# Altium schematic sheet Power.SchDoc
size 292 x 193 mm; Author: Power Lin; SheetNumber: 1; SheetTotal: 1; Website: wiki-power.com
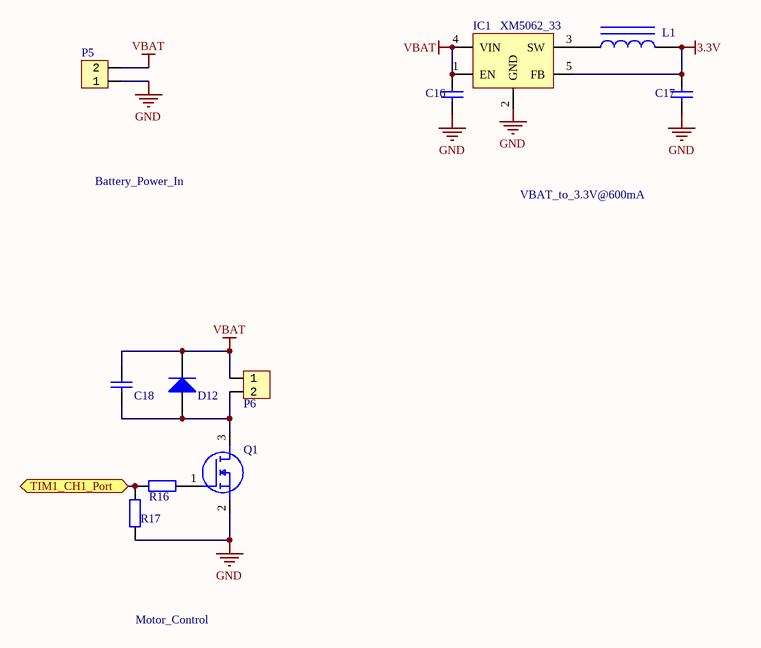
[diagram p0: Power.SchDoc]

## Parts
C16  4.7uF  [CAP-0603]  (value not drawn)
C17  10uF  [CAP-0603]  (value not drawn)
C18  10uF  [CAP-0603]  (value not drawn)
D12  SS14  [DO-214AC_SMA]  (value not drawn)
IC1  XM5062_33  [SOT-23-5]
L1  2.2uH  [XAL6060-103MEB]  (value not drawn)
P5  HDR1x2_2.54  [HDR1X2_2.54_180]  (value not drawn)
P6  HDR1x2_2.54  [HDR1X2_2.54_180]  (value not drawn)
Q1  SI2302DS  [SOT-23-3]  (value not drawn)
R16  22R  [R-0603]  (value not drawn)
R17  10K  [R-0603]  (value not drawn)

## Ports
TIM1_CH1_Port (bidir)

## Nets
3.3V: C17.2 IC1.5(FB) L1.2
GND: C16.1 C17.1 IC1.2(GND) P5.1 Q1.2(S) R17.1
VBAT: C16.2 C18.2 D12.2(K) IC1.1(EN) IC1.4(VIN) P5.2 P6.1
TIM1_CH1_Port: R16.1 R17.2 ; port TIM1_CH1_Port
NetC18_1: C18.1 D12.1(A) P6.2 Q1.3(D)
NetIC1_3: IC1.3(SW) L1.1
NetQ1_1: Q1.1(G) R16.2

## Notes on the sheet
- Battery_Power_In
- VBAT_to_3.3V@600mA
- Motor_Control
- Author
- DocumentName
- ModifiedDate
- ProjectName
- SheetNumber
- SheetTotal
- Website
- Revision

## Library data of the parts
C16-C18 = CAP: 贴片电容; ComponentLink1Description: 供应商链接; ComponentLink1URL: http://www.szlcsc.com/product/details_53938.html; Package: 0402; Supplier: LC; SuppliersPartNumber: C52923
D12 = DIODE: 二极管; ComponentLink1Description: 供应商链接; ComponentLink1URL: http://www.szlcsc.com/product/details_23178.html; Package: SMA(DO-214AC); Supplier: LC; SuppliersPartNumber: C22452
IC1 = XM5062: 降压转换芯片; Manufacturer_Name: TE Connectivity; Manufacturer_Part_Number: 1-1393258-5; Datasheet Link: http://www.te.com/commerce/DocumentDelivery/DDEController?Action=showdoc&DocId=Data+Sheet%7FSR2M%7F1116%7Fpdf%7FEnglish%7FENG_DS_SR2M_1116.pdf%7F1-1393258-5; Height: 25mm
L1 = INDUCTOR: 贴片电感; ComponentLink1Description: 供应商链接; ComponentLink1URL: http://www.szlcsc.com/product/details_33003.html; Package: 0402; Supplier: LC; SuppliersPartNumber: C32041
P5 P6 = HDR1x2_2.54: Header
Q1 = N-MOS: N 沟道 MOS; Manufacturer_Name: Nexperia; Datasheet Link: https://assets.nexperia.com/documents/data-sheet/SI2302DS.pdf; Height: 1.1mm; Manufacturer_Part_Number: SI2302DS; Mouser Part Number: N/A; Mouser Price/Stock: https://www.mouser.com/Search/Refine.aspx?Keyword=N%2FA; RS Part Number: 7983053P; RS Price/Stock: http://uk.rs-online.com/web/p/products/7983053P
R16 R17 = RES: 贴片电阻; Package: 0805; Supplier: LC; SuppliersPartNumber: C17798